# Altium schematic sheet cape.SchDoc: Cape
size A4; DrawnBy: Stefan Lippuner; Organization: TIK; DocumentNumber: 2; Revision: 2; SheetNumber: 2; SheetTotal: 8
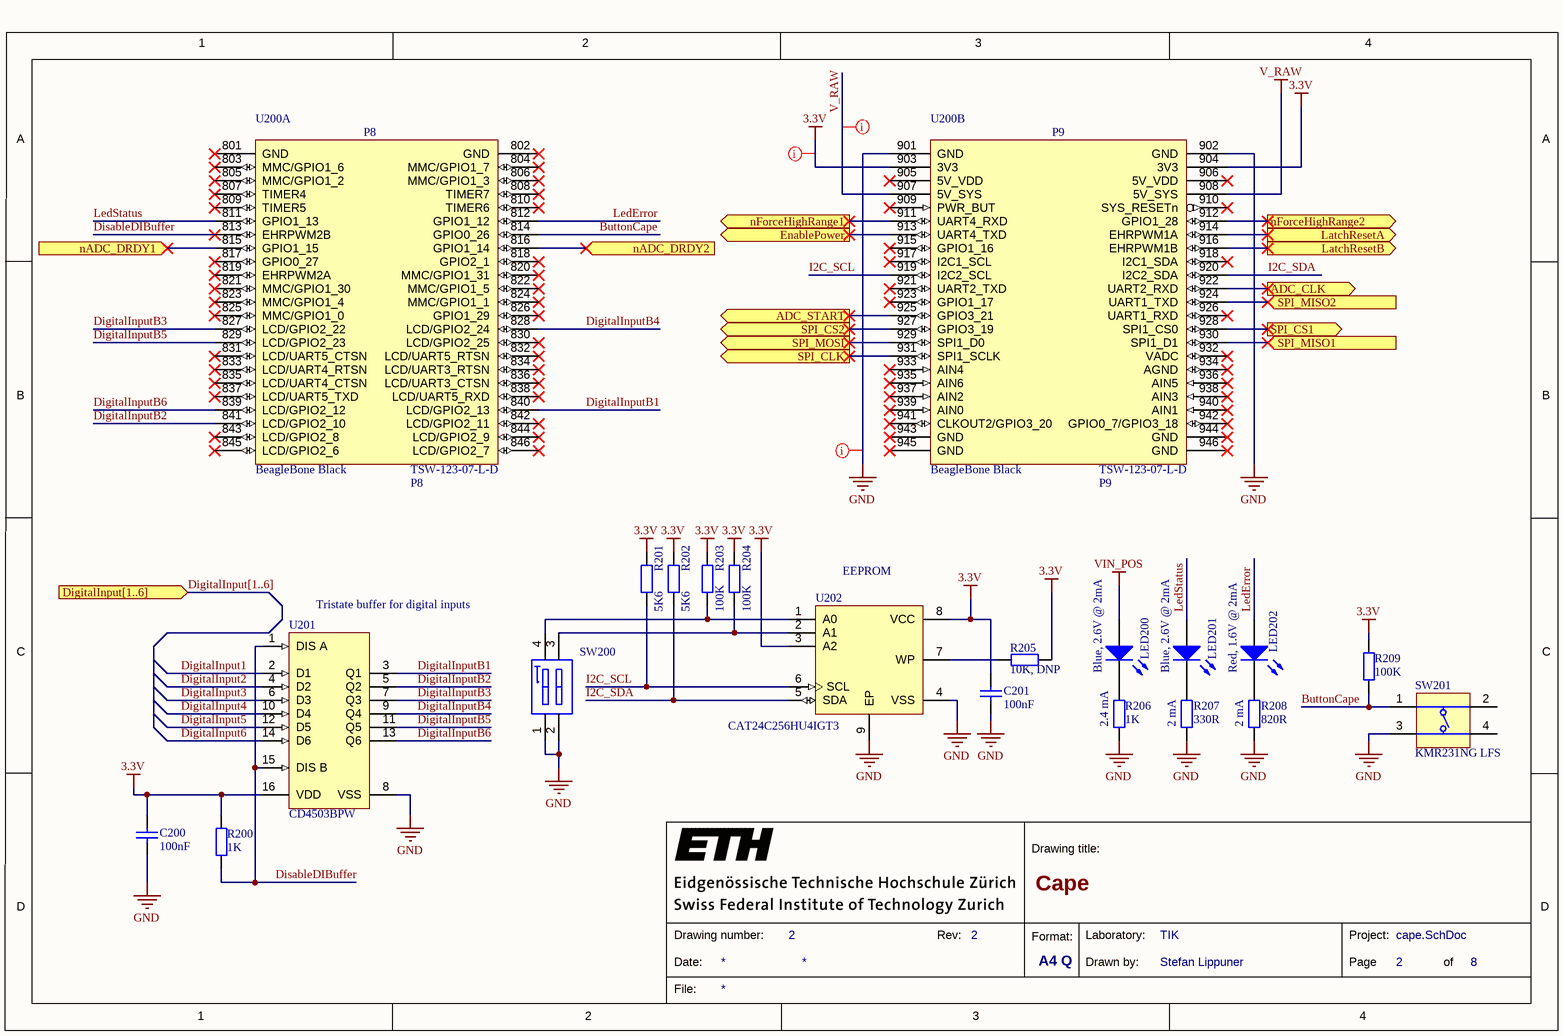
[diagram p0: cape.SchDoc]

## Parts
C200  100nF  [CAPC0402(1005)60_L]
C201  100nF  [CAPC0402(1005)60_L]
LED200  Blue, 2.6V @ 2mA  [0603_A]
LED201  Blue, 2.6V @ 2mA  [0603_A]
LED202  Red, 1.6V @ 2mA  [0603_A]
P8  TSW-123-07-L-D (BOM)  (value not drawn)  (mechanical)
P9  TSW-123-07-L-D (BOM)  (value not drawn)  (mechanical)
R200  1K  [RESC0402(1005)_L]
R201  5K6  [RESC0402(1005)_L]
R202  5K6  [RESC0402(1005)_L]
R203  100K  [RESC0402(1005)_L]
R204  100K  [RESC0402(1005)_L]
R205  10K, DNP  [RESC0402(1005)_L]  (no BOM)
R206  1K  [RESC0402(1005)_L]
R207  330R  [RESC0402(1005)_L]
R208  820R  [RESC0402(1005)_L]
R209  100K  [RESC0402(1005)_L]
SW200  218-2LPST  [416131160802]  (value not drawn)
SW201  KMR231NG LFS  [KRM 2 Series]
U200  BeagleBone Black  (parts A,B of 2)  (no BOM)
U201  CD4503BPW  [PW0016A_L]
U202  CAT24C256HU4IGT3  [UDFN-MU8]

## Ports
ADC_CLK (out), ADC_START (out), DigitalInput[1..6] (in), EnablePower (out), LatchResetA (out), LatchResetB (out), nADC_DRDY1 (in), nADC_DRDY2 (in), nForceHighRange1 (out), nForceHighRange2 (out), SPI_CLK (out), SPI_CS1 (out), SPI_CS2 (out), SPI_MISO1 (in), SPI_MISO2 (in), SPI_MOSI (out)

## Nets
3.3V: C200.2 C201.2 R200.2 R201.2 R202.2 R203.2 R204.2 R205.2 R209.2 U200.903(3V3) U200.904(3V3) U201.16(VDD) U202.3(A2) U202.8(VCC)
GND: C200.1 C201.1 R206.1 R207.1 R208.1 SW200.1 SW200.2 SW201.3(T3) U200.901(GND) U200.902(GND) U201.8(VSS) U202.4(VSS) U202.9(EP)
V_RAW: U200.907(5V_SYS) U200.908(5V_SYS)
VIN_POS: LED200.2(A)
ADC_CLK: U200.922(UART2_RXD) ; port ADC_CLK
ADC_START: U200.925(GPIO3_21) ; port ADC_START
ButtonCape: R209.1 SW201.1(T1) U200.814(GPIO0_26)
DigitalInput1: U201.2(D1)
DigitalInput2: U201.4(D2)
DigitalInput3: U201.6(D3)
DigitalInput4: U201.10(D4)
DigitalInput5: U201.12(D5)
DigitalInput6: U201.14(D6)
DigitalInputB1: U200.840(LCD/GPIO2_13) U201.3(Q1)
DigitalInputB2: U200.841(LCD/GPIO2_10) U201.5(Q2)
DigitalInputB3: U200.827(LCD/GPIO2_22) U201.7(Q3)
DigitalInputB4: U200.828(LCD/GPIO2_24) U201.9(Q4)
DigitalInputB5: U200.829(LCD/GPIO2_23) U201.11(Q5)
DigitalInputB6: U200.839(LCD/GPIO2_12) U201.13(Q6)
DisableDIBuffer: R200.1 U200.813(EHRPWM2B) U201.1(DIS_A) U201.15(DIS_B)
EnablePower: U200.913(UART4_TXD) ; port EnablePower
I2C_SCL: R201.1 U200.919(I2C2_SCL) U202.6(SCL)
I2C_SDA: R202.1 U200.920(I2C2_SDA) U202.5(SDA)
LatchResetA: U200.914(EHRPWM1A) ; port LatchResetA
LatchResetB: U200.916(EHRPWM1B) ; port LatchResetB
LedError: LED202.2(A) U200.812(GPIO1_12)
LedStatus: LED201.2(A) U200.811(GPIO1_13)
nADC_DRDY1: U200.815(GPIO1_15) ; port nADC_DRDY1
nADC_DRDY2: U200.816(GPIO1_14) ; port nADC_DRDY2
nForceHighRange1: U200.911(UART4_RXD) ; port nForceHighRange1
nForceHighRange2: U200.912(GPIO1_28) ; port nForceHighRange2
SPI_CLK: U200.931(SPI1_SCLK) ; port SPI_CLK
SPI_CS1: U200.928(SPI1_CS0) ; port SPI_CS1
SPI_CS2: U200.927(GPIO3_19) ; port SPI_CS2
SPI_MISO1: U200.930(SPI1_D1) ; port SPI_MISO1
SPI_MISO2: U200.924(UART1_TXD) ; port SPI_MISO2
SPI_MOSI: U200.929(SPI1_D0) ; port SPI_MOSI
NetLED200_1: LED200.1(K) R206.2
NetLED201_1: LED201.1(K) R207.2
NetLED202_1: LED202.1(K) R208.2
NetR203_1: R203.1 SW200.4 U202.1(A0)
NetR204_1: R204.1 SW200.3 U202.2(A1)
NetR205_1: R205.1 U202.7(WP)

Not connected (* = marked no-connect by the designer): SW201 2(T2) 4(T3); U200 801(GND)* 802(GND)* 803(MMC/GPIO1_6)* 804(MMC/GPIO1_7)* 805(MMC/GPIO1_2)* 806(MMC/GPIO1_3)* 807(TIMER4)* 808(TIMER7)* 809(TIMER5)* 810(TIMER6)* 817(GPIO0_27)* 818(GPIO2_1)* 819(EHRPWM2A)* 820(MMC/GPIO1_31)* 821(MMC/GPIO1_30)* 822(MMC/GPIO1_5)* 823(MMC/GPIO1_4)* 824(MMC/GPIO1_1)* 825(MMC/GPIO1_0)* 826(GPIO1_29)* 830(LCD/GPIO2_25)* 831(LCD/UART5_CTSN)* 832(LCD/UART5_RTSN)* 833(LCD/UART4_RTSN)* 834(LCD/UART3_RTSN)* 835(LCD/UART4_CTSN)* 836(LCD/UART3_CTSN)* 837(LCD/UART5_TXD)* 838(LCD/UART5_RXD)* 842(LCD/GPIO2_11)* 843(LCD/GPIO2_8)* 844(LCD/GPIO2_9)* 845(LCD/GPIO2_6)* 846(LCD/GPIO2_7)* 905(5V_VDD)* 906(5V_VDD)* 909(PWR_BUT)* 910(SYS_RESETn)* 915(GPIO1_16)* 917(I2C1_SCL)* 918(I2C1_SDA)* 921(UART2_TXD)* 923(GPIO1_17)* 926(UART1_RXD)* 932(VADC)* 933(AIN4)* 934(AGND)* 935(AIN6)* 936(AIN5)* 937(AIN2)* 938(AIN3)* 939(AIN0)* 940(AIN1)* 941(CLKOUT2/GPIO3_20)* 942(GPIO0_7/GPIO3_18)* 943(GND)* 944(GND)* 945(GND)* 946(GND)*

## Buses and harness runs
bus DigitalInput[1..6] = port DigitalInput[1..6]

## Layout directives
net class Power: 3.3V, GND, V_RAW

## Notes on the sheet
- (near U202) EEPROM
- Tristate buffer for digital inputs
- (near R206) 2.4 mA
- (near R207) 2 mA
- (near R208) 2 mA
- 1
- 2
- 3
- 4
- A
- B
- C
- Drawing title:
- D
- Date:
- Drawing number:
- Rev:
- Format:
- A4 Q
- Drawn by:
- Laboratory:
- Page
- Project:
- of
- File:
- (in symbol CMP-00111-2, part A) P8
- (in symbol CMP-00111-2, part B) P9
- (in symbol TSW-123-07-L-D (BOM)) TSW-123-07-L-D

## Library data of the parts
C200 C201 = CMP-1034-02071-1: CAP 100nF 16V -20% to +80% 0402 (1005 Metric) Thickness 0.6mm SMD; Case-Metric: 1005; Case-EIA: 0402; Value: 100nF; Rated Voltage: 16 V; Tolerance: -20% to +80%; Technology: SMT; Max Thickness: 0.6 mm
LED200 LED201 = CMP-1426-00003-1: SMD mono-color Chip LED, WL-SMCW, Blue; PartNumber: 150060BS75000; Manufacturer: Wuerth Elektronik; Color: Blue; ComponentLink2Description: Datasheet; ComponentLink2URL: http://katalog.we-online.com/led/datasheet/150060BS75000.pdf; ComponentLink1URL: http://www.we-online.com; PackageReference: 0603_A; ComponentLink1Description: Manufacturer URL
LED202 = CMP-1426-00001-1: SMD mono-color Chip LED, WL-SMCW, Red; Manufacturer: Wuerth Elektronik; PartNumber: 150060RS75000; Color: Red; PackageReference: 0603_A; ComponentLink2URL: http://katalog.we-online.com/led/datasheet/150060RS75000.pdf; ComponentLink1URL: http://www.we-online.com; ComponentLink1Description: Manufacturer URL; ComponentLink2Description: Datasheet
P8 P9 = TSW-123-07-L-D (BOM): Conn Unshrouded Header HDR 46 POS 2.54mm Solder ST Thru-Hole; Supplier 1: Digi-Key; Supplier Part Number 1: SAM1030-23-ND
R200 = CMP-1011-00510-1: 1K 0.063W 1% 0402 (1005 Metric)  SMD; Case-EIA: 0402; Value: 1000.00 Ohm; Case-Metric: 1005; Technology: SMT; Tolerance: 1 %; Power: 0.063 W
R201 R202 = CMP-1011-00092-1: 5K6 0.063W 5% 0402 (1005 Metric)  SMD; Case-EIA: 0402; Case-Metric: 1005; Value: 5600.00 Ohm; Technology: SMT; Tolerance: 5 %; Power: 0.063 W
R203 R204 = CMP-1011-00736-1: 100K 0.063W 1% 0402 (1005 Metric)  SMD; Value: 100000.00 Ohm; Case-EIA: 0402; Case-Metric: 1005; Power: 0.063 W; Technology: SMT; Tolerance: 1 %
R205 = CMP-1011-00623-1: 10K 0.063W 1% 0402 (1005 Metric)  SMD; Case-Metric: 1005; Value: 10000.00 Ohm; Case-EIA: 0402; Tolerance: 1 %; Technology: SMT; Power: 0.063 W
R206 = CMP-1011-00510-1: 1K 0.063W 1% 0402 (1005 Metric)  SMD; Value: 1000.00 Ohm; Case-EIA: 0402; Case-Metric: 1005; Tolerance: 1 %; Power: 0.063 W; Technology: SMT
R207 = CMP-1011-00062-1: 330R 0.063W 5% 0402 (1005 Metric)  SMD; Case-EIA: 0402; Value: 330.00 Ohm; Case-Metric: 1005; Tolerance: 5 %; Technology: SMT; Power: 0.063 W
R208 = CMP-1011-00072-1: 820R 0.063W 5% 0402 (1005 Metric)  SMD; Value: 820.00 Ohm; Case-Metric: 1005; Case-EIA: 0402; Tolerance: 5 %; Technology: SMT; Power: 0.063 W
R209 = CMP-1011-00736-1: 100K 0.063W 1% 0402 (1005 Metric)  SMD; Case-Metric: 1005; Value: 100000.00 Ohm; Case-EIA: 0402; Tolerance: 1 %; Technology: SMT; Power: 0.063 W
SW200 = CMP-00125-1: Switch DIP ON OFF SPST 2 Recessed Slide 0.025A 24VDC Gull Wing 1.27mm SMD; Manufacturer: CTS Electrocomponents; Number of Positions: 2; Current Rating: 25mA; Actuator Type: Slide (Standard); Actuator Level: Flush, Recessed; Pitch: 0.050" (1.27mm), Half; Washable: Yes; Electrical Life: 1,000 Cycles; Packaging: Tube; Circuit: SPST; Voltage Rating: 24VDC; Contact Material: Beryllium Copper; Contact Finish: Gold; Height Above Board: 0.104" (2.65mm); Mounting Type: Surface Mount; Termination Style: Gull Wing; Features: Epoxy Sealed Terminals, Tape Seal; Body Material: -; Length: 0.146" (3.71mm); Operating Temperature: -55°C ~ 85°C; Mechanical Life: -; Manufacturer Part Number: 218-2LPST; Supplier: Digi-Key; Supplier Part Number: CT2182LPST-ND; ComponentLink1Description: 218.pdf; ComponentLink1URL: http://www.ctscorp.com/wp-content/uploads/2015/11/218.pdf
SW201 = CMP-00230-1: SWITCH TACTILE SPST-NO 0.05A 32V; Manufacturer: C&K Components; Switch Function: Off-Mom; Contact Rating @ Voltage: 0.05A @ 32VDC; Actuator Type: Standard; Actuator Height off PCB, from Pins: 1.90mm; Actuator Orientation: Top Actuated; Outline: 4.60mm x 2.80mm; Illumination: Non-Illuminated; Operating Force: 300gf; Switch Travel: 0.25mm; Mechanical Life: 150,000 Cycles; Packaging: Cut Tape (CT); Part Status: Active; Circuit: SPST-NO; Mounting Type: Surface Mount; Termination Style: Gull Wing; Illumination Voltage (Nominal): -; Illumination Type, Color: -; Ingress Protection: -; Features: -; Actuator Material: -; Operating Temperature: -40°C ~ 85°C; Manufacturer Part Number: KMR231NG LFS; Supplier: Digi-Key; Supplier Part Number: CKN10246CT-ND; ComponentLink1Description: kmr2.pdf; ComponentLink1URL: http://www.ck-components.com/media/1479/kmr2.pdf
U200 = CMP-00111-2
U201 = CMP-0440-01132-3: CMOS Hex Non-Inverting Buffer with 3-State Outputs, PW0016A, TUBE; Manufacturer: Texas Instruments; ICC @ Nom Voltage(Max)(mA): 0.06; F @ Nom Voltage(Max)(Mhz): 8; tpd @ Nom Voltage(Max)(ns): 150; Voltage(Nom)(V): 10; VCC(Max)(V): 18; Bits(#): 6; VCC(Min)(V): 3; Rating: Catalog; ComponentLink2Description: Datasheet; Generic Part Number: CD4503B; Input Type: CMOS; DatasheetVersion: SCHS068C; ComponentLink1Description: Manufacturer URL; Code_IPC: MO-153; PackageVersion: http://www.ti.com/lit/ml/mpds361/mpds361.pdf; ComponentLink2URL: http://www.ti.com/lit/ds/symlink/cd4503b.pdf; Operating Temperature Range(C): -55 to 125; Code_JEITA: 1.2; PackageReference: PW0016A; Output Type: CMOS; ComponentLink1URL: http://www.ti.com/; PartNumber: CD4503BPW; Code_JEDEC: MO-153
U202 = CMP-00107-1: IC EEPROM 256KBIT 400KHZ 8UDFN; Manufacturer: ON Semiconductor; Format - Memory: EEPROMs - Serial; Memory Size: 256K (32K x 8); Interface: I²C, 2-Wire Serial; Voltage - Supply: 1.8 V ~ 5.5 V; Packaging: Tape & Reel (TR); Memory Type: EEPROM; Speed: 400kHz; Operating Temperature: -40°C ~ 85°C (TA); Package / Case: 8-UFDFN Exposed Pad; Supplier Device Package: 8-UDFN (2x3); P/N: CAT24C256HU4IGT3; Supplier: Digi-Key; Supplier Part Number: CAT24C256HU4IGT3OSTR-ND; ComponentLink1Description: CAT24C256-D.PDF; ComponentLink1URL: http://www.onsemi.com/pub_link/Collateral/CAT24C256-D.PDF